# Altium schematic sheet BoostConverter.SchDoc
size A4
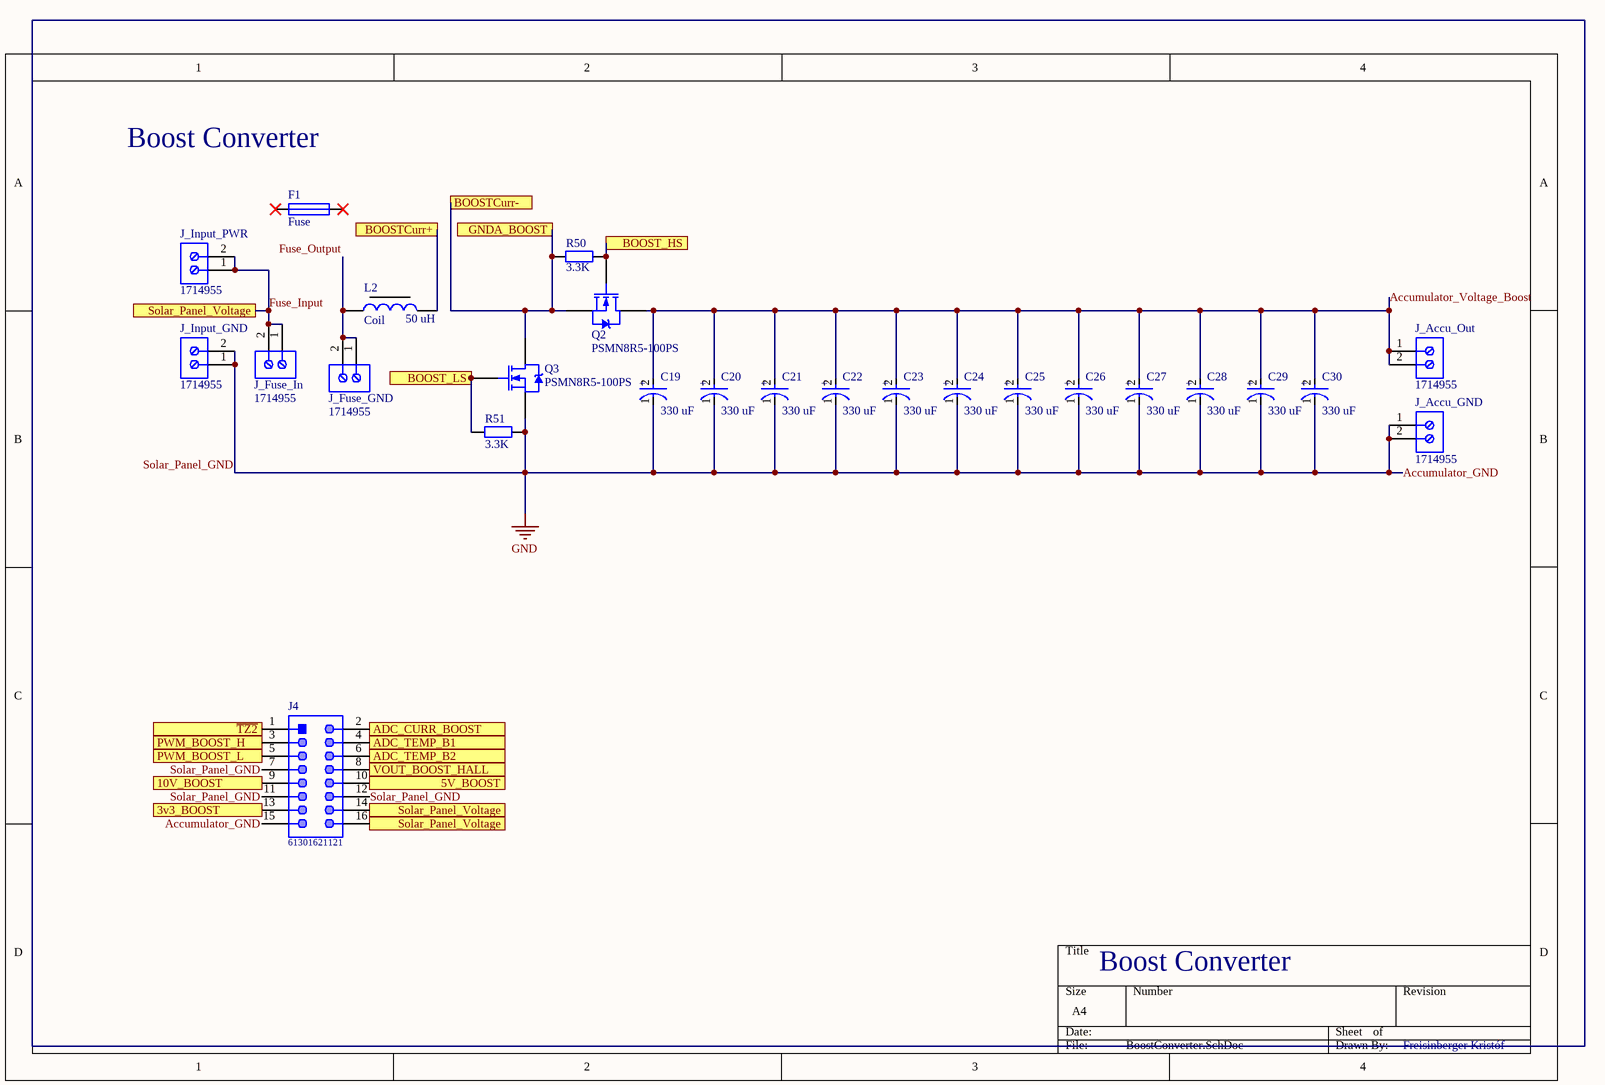
[diagram p0: BoostConverter.SchDoc]

## Parts
C19  330 uF  [FP-LXW18X25-MFG]
C20  330 uF  [FP-LXW18X25-MFG]
C21  330 uF  [FP-LXW18X25-MFG]
C22  330 uF  [FP-LXW18X25-MFG]
C23  330 uF  [FP-LXW18X25-MFG]
C24  330 uF  [FP-LXW18X25-MFG]
C25  330 uF  [FP-LXW18X25-MFG]
C26  330 uF  [FP-LXW18X25-MFG]
C27  330 uF  [FP-LXW18X25-MFG]
C28  330 uF  [FP-LXW18X25-MFG]
C29  330 uF  [FP-LXW18X25-MFG]
C30  330 uF  [FP-LXW18X25-MFG]
F1  Fuse
J4  61301621121  [61301621121]
J_Accu_GND  1714955  [Terminal-PHOE-1714955_V]
J_Accu_Out  1714955  [Terminal-PHOE-1714955_V]
J_Fuse_GND  1714955  [Terminal-PHOE-1714955_V]
J_Fuse_In  1714955  [Terminal-PHOE-1714955_V]
J_Input_GND  1714955  [Terminal-PHOE-1714955_V]
J_Input_PWR  1714955  [Terminal-PHOE-1714955_V]
L2  Coil  value 50 uH  [Tekercs_E65_FERRITE]
Q2  PSMN8R5-100PS  [FP-TO-220AB-MFG]
Q3  PSMN8R5-100PS  [FP-TO-220AB-MFG]
R50  3.3K  [FP_0805_RES]
R51  3.3K  [FP_0805_RES]

## Ports
3v3_BOOST, 5V_BOOST, 10V_BOOST, ADC_CURR_BOOST, ADC_TEMP_B1, ADC_TEMP_B2, BOOST_HS, BOOST_LS, BOOSTCurr+, BOOSTCurr-, GNDA_BOOST, PWM_BOOST_H, PWM_BOOST_L, Solar_Panel_Voltage, VOUT_BOOST_HALL, ~{TZ2}

## Nets
Accumulator_GND: C19.1(C) C20.1(C) C21.1(C) C22.1(C) C23.1(C) C24.1(C) C25.1(C) C26.1(C) C27.1(C) C28.1(C) C29.1(C) C30.1(C) J4.7 J4.11 J4.12 J4.15 J_Accu_GND.1 J_Accu_GND.2 J_Input_GND.1 J_Input_GND.2 Q3.3(S) R51.2  [also labelled GND, Solar_Panel_GND]
3v3_BOOST: J4.13 ; port 3v3_BOOST
5V_BOOST: J4.10 ; port 5V_BOOST
10V_BOOST: J4.9 ; port 10V_BOOST
Accumulator_Voltage_Boost: C19.2(A) C20.2(A) C21.2(A) C22.2(A) C23.2(A) C24.2(A) C25.2(A) C26.2(A) C27.2(A) C28.2(A) C29.2(A) C30.2(A) J_Accu_Out.1 J_Accu_Out.2 Q2.2(D)
ADC_CURR_BOOST: J4.2 ; port ADC_CURR_BOOST
ADC_TEMP_B1: J4.4 ; port ADC_TEMP_B1
ADC_TEMP_B2: J4.6 ; port ADC_TEMP_B2
BOOST_HS: Q2.1(G) R50.2 ; port BOOST_HS
BOOST_LS: Q3.1(G) R51.1 ; port BOOST_LS
BOOSTCurr+: L2.2(Out) ; port BOOSTCurr+
BOOSTCurr-: Q2.3(S) Q3.2(D) R50.1 ; port BOOSTCurr-, port GNDA_BOOST
Fuse_Input: J4.14 J4.16 J_Fuse_In.1 J_Fuse_In.2 J_Input_PWR.1 J_Input_PWR.2 ; port Solar_Panel_Voltage
Fuse_Output: J_Fuse_GND.1 J_Fuse_GND.2 L2.1(In)
PWM_BOOST_H: J4.3 ; port PWM_BOOST_H
PWM_BOOST_L: J4.5 ; port PWM_BOOST_L
~{TZ2}: J4.1 ; port ~{TZ2}
VOUT_BOOST_HALL: J4.8 ; port VOUT_BOOST_HALL

Not connected (* = marked no-connect by the designer): F1 1* 2*

## Notes on the sheet
- Boost Converter
- Freisinberger Kristóf
- (in symbol CMP-35376-000008-1) +

## Library data of the parts
C19-C30 = CMP-35376-000008-1: CAP ALUM 47UF 20% 500V THRUHOLE / 500LXW47MEFR18X25
F1 = Fuse_Fork_Lift_157.5700.5501: LITTELFUSE   157.5700.5501   Automotive Fuse, Fork Lift Truck, 157.5700 Series, 50 A, Fast Acting, 48 V; Body Material: ZINC ALLOY; Current Rating: 50A; Voltage Rating (DC): 48V; Type: Electrical; Voltage Rating: 80V; Supplier 1: Digi-Key; Manufacturer: Littelfuse; Manufacturer Part Number: 157.5700.5501; RoHS: Yes; Category: Fuses; Stock 1: 20; Pricing 1: 1=1,98000, 5=1,89000, 10=1,79600, 50=1,44900, 100=1,22850, 250=1,19700, 500=1,00800, 1000=0,89775, 5000=0,83790 (USD); Mount: Bolt; Min Operating Temperature: -40°C; Max Operating Temperature: 125°C; Fuse Current: 50A; Packaging: Bulk; Series: -; Termination: Lug; Length: 82mm; Width: 20mm; Height: 0.03inch; REACH SVHC: Unknown; RoHS Compliant: Yes; ComponentLink1URL: https://datasheet.ciiva.com/1729/68907-1729142.pdf?src-supplier=Newark; ComponentLink1Description: https://datasheet.ciiva.com/1729/68907-1729142.pdf?src-supplier=Newark; ComponentLink2URL: https://datasheet.ciiva.com/1547/68907-1547992.pdf?src-supplier=Element14; ComponentLink2Description: https://datasheet.ciiva.com/1547/68907-1547992.pdf?src-supplier=Element14
J4 = CMP-1502-01097-1: THT Vertical Pin Header WR-PHD, Pitch 2.54 mm, Dual Row, 16 pins; Manufacturer: Wurth Elektronik; Gender: Male; Rated Current: 3A; Pitch: 2.54mm; Withstanding Voltage: 500VAC; Contact Resistance: 20mOhm; Working Voltage: 250VAC; Pin Number: 16; Mounting Technology: THT; Orientation: Vertical; Manufacturer URL: http://www.we-online.de; Row Number: Dual; Part Number: 61301621121; Datasheet URL: https://katalog.we-online.de/em/datasheet/6130xx21121.pdf; Packaging: Bag; Operating Temperature: -40to105degC; Publisher: WurthElektronik; Package Reference: 61301621121
J_Accu_GND J_Accu_Out J_Fuse_GND J_Fuse_In J_Input_GND J_Input_PWR = Terminal-CMP-2000-05797-1: PC Terminal Block, Pitch 6.35 mm, 1 x 2 Position, Height 21.5 mm, Tail Lenght 5.1 mm, RoHS, Bulk; Manufacturer: Phoenix Contact; Package Description: PC Terminal Block, Pitch 6.35 mm, 1 x 2 Position, Height 21.5 mm, Tail Lenght 5.1 mm; Datasheet URL: http://media.digikey.com/pdf/Data%20Sheets/Phoenix%20Contact%20PDFs/1714955.pdf; Package Reference: 1714955; Manufacturer URL: http://www.phoenixcontact.com/; Datasheet Version: 02/2010; Mounting Technology: ThroughHole
L2 = Coil: 50 uH; Category: Inductor
Q2 Q3 = NMOS-2: N-channel 100 V 8.5 mΩ standard level MOSFET in TO220; Note: Pin 2 is electrically connected to pin 4.; Published: 8-Jun-2000; LatestRevisionDate: 17-Jul-2002; LatestRevisionNote: Re-released for DXP Platform.; DatasheetVersion: PD-9.814; PackageVersion: Feb-1997; PackageReference: TO-220AB; Publisher: Altium Limited; PackageDescription: TO, Thru-Hole, Vertical, Heatsink Mounted; 3 In-Line Leads; Pitch 2.54 mm; ComponentLink1Description: Manufacturer Link; ComponentLink1URL: http://www.irf.com/
R50 R51 = RES: Resistor; Value: 3.3K